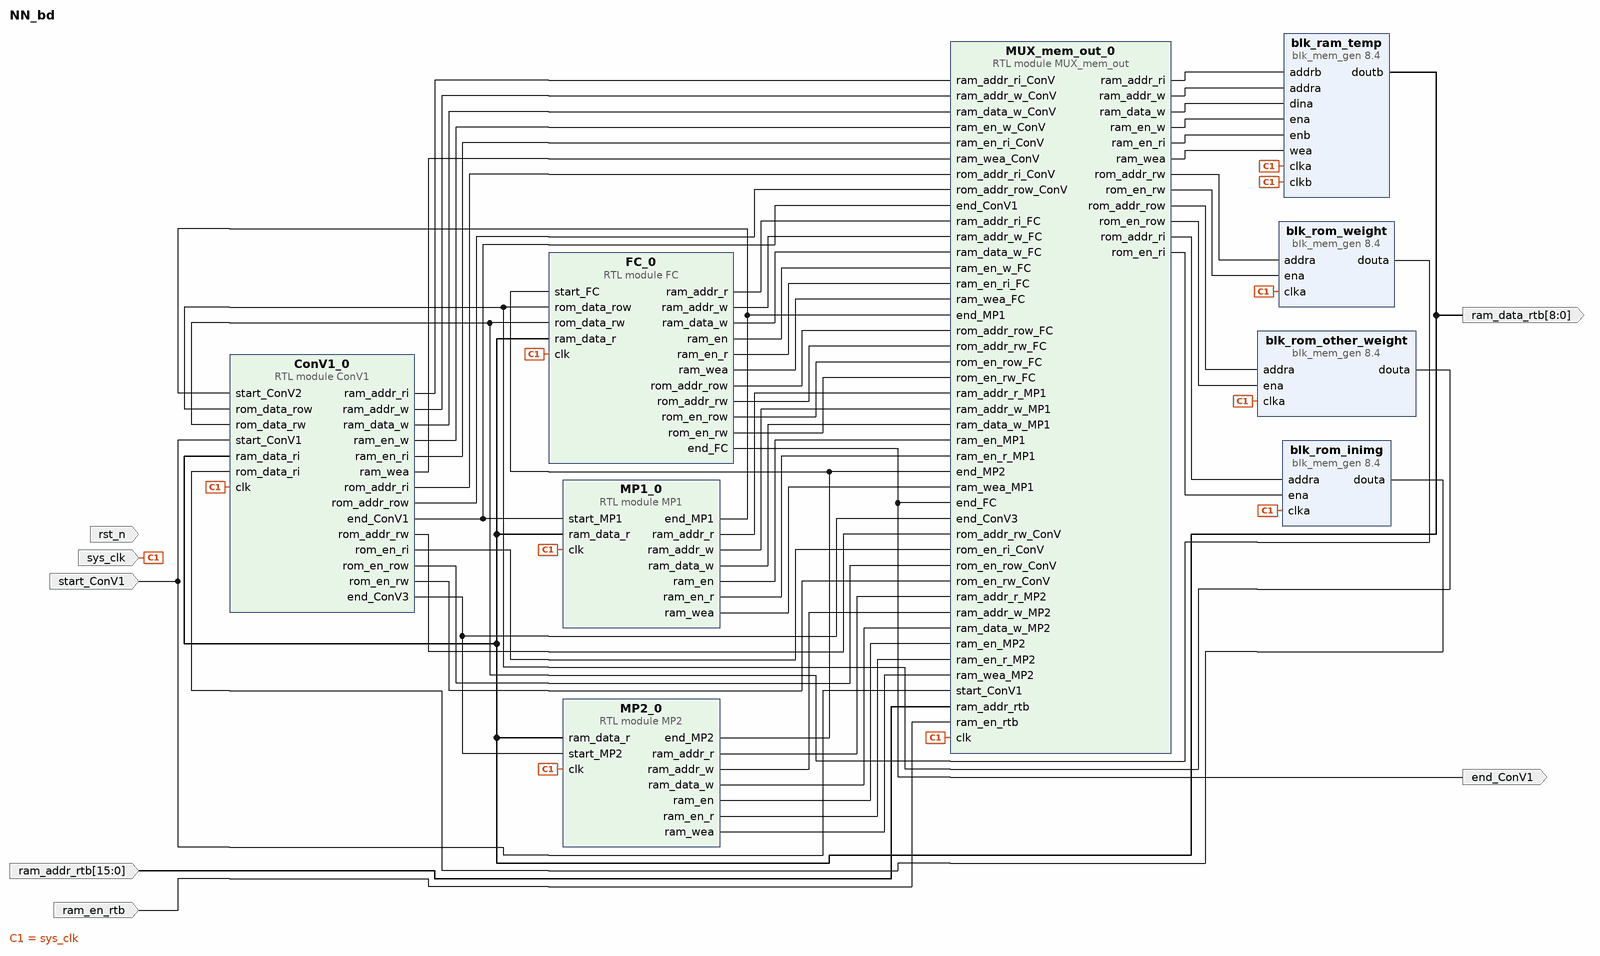
[diagram p0: block diagram of the top level]
# Vivado block design NN_bd, xc7z020clg400-1, Vivado 2021.2
create_bd_design NN_bd

create_bd_port -dir I start_ConV1
create_bd_port -dir I sys_clk
create_bd_port -dir I -from 15 -to 0 ram_addr_rtb
create_bd_port -dir I ram_en_rtb
create_bd_port -dir O end_ConV1
create_bd_port -dir O -from 8 -to 0 ram_data_rtb
create_bd_port -dir I rst_n

create_bd_cell -type ip -vlnv xilinx.com:ip:blk_mem_gen:8.4 blk_rom_weight
set_property -dict [list \
  CONFIG.Coe_File {../../../../../../../CNN_information/coe file/weight.coe} \
  CONFIG.Enable_32bit_Address false \
  CONFIG.Load_Init_File true \
  CONFIG.Memory_Type Single_Port_ROM \
  CONFIG.Port_A_Write_Rate 0 \
  CONFIG.Register_PortA_Output_of_Memory_Primitives true \
  CONFIG.Use_RSTA_Pin false \
  CONFIG.Write_Depth_A 32768 \
  CONFIG.Write_Width_A 8 \
  CONFIG.use_bram_block Stand_Alone \
] [get_bd_cells blk_rom_weight]
create_bd_cell -type ip -vlnv xilinx.com:ip:blk_mem_gen:8.4 blk_rom_other_weight
set_property -dict [list \
  CONFIG.Coe_File {../../../../../../../CNN_information/coe file/M0_bias.coe} \
  CONFIG.Enable_32bit_Address false \
  CONFIG.Load_Init_File true \
  CONFIG.Memory_Type Single_Port_ROM \
  CONFIG.Port_A_Write_Rate 0 \
  CONFIG.Register_PortA_Output_of_Memory_Primitives true \
  CONFIG.Use_RSTA_Pin false \
  CONFIG.Write_Depth_A 512 \
  CONFIG.use_bram_block Stand_Alone \
] [get_bd_cells blk_rom_other_weight]
create_bd_cell -type ip -vlnv xilinx.com:ip:blk_mem_gen:8.4 blk_ram_temp
set_property -dict [list \
  CONFIG.Assume_Synchronous_Clk false \
  CONFIG.Enable_32bit_Address false \
  CONFIG.Enable_B Use_ENB_Pin \
  CONFIG.Load_Init_File false \
  CONFIG.Memory_Type Simple_Dual_Port_RAM \
  CONFIG.Operating_Mode_A NO_CHANGE \
  CONFIG.Port_B_Clock 100 \
  CONFIG.Port_B_Enable_Rate 100 \
  CONFIG.Read_Width_B 9 \
  CONFIG.Register_PortB_Output_of_Memory_Primitives true \
  CONFIG.Use_Byte_Write_Enable false \
  CONFIG.Write_Depth_A 65536 \
  CONFIG.Write_Width_A 9 \
  CONFIG.Write_Width_B 9 \
  CONFIG.use_bram_block Stand_Alone \
] [get_bd_cells blk_ram_temp]
create_bd_cell -type ip -vlnv xilinx.com:ip:blk_mem_gen:8.4 blk_rom_inimg
set_property -dict [list \
  CONFIG.Coe_File {../../../../../../../CNN_information/coe file/input_coe/input_image.coe} \
  CONFIG.Enable_32bit_Address false \
  CONFIG.Load_Init_File true \
  CONFIG.Memory_Type Single_Port_ROM \
  CONFIG.Port_A_Write_Rate 0 \
  CONFIG.Register_PortA_Output_of_Memory_Primitives true \
  CONFIG.Use_RSTA_Pin false \
  CONFIG.Write_Depth_A 4096 \
  CONFIG.Write_Width_A 8 \
  CONFIG.use_bram_block Stand_Alone \
] [get_bd_cells blk_rom_inimg]
create_bd_cell -type module -reference MP1 MP1_0
create_bd_cell -type module -reference ConV1 ConV1_0
create_bd_cell -type module -reference MUX_mem_out MUX_mem_out_0
create_bd_cell -type module -reference FC FC_0
create_bd_cell -type module -reference MP2 MP2_0

# ---- connections ----

connect_bd_net [get_bd_pins ConV1_0/end_ConV1] [get_bd_pins MP1_0/start_MP1] [get_bd_pins MUX_mem_out_0/end_ConV1]
connect_bd_net [get_bd_pins ConV1_0/end_ConV3] [get_bd_pins MUX_mem_out_0/end_ConV3] [get_bd_pins MP2_0/start_MP2]
connect_bd_net [get_bd_pins ConV1_0/ram_addr_ri] [get_bd_pins MUX_mem_out_0/ram_addr_ri_ConV]
connect_bd_net [get_bd_pins ConV1_0/ram_addr_w] [get_bd_pins MUX_mem_out_0/ram_addr_w_ConV]
connect_bd_net [get_bd_pins ConV1_0/ram_data_w] [get_bd_pins MUX_mem_out_0/ram_data_w_ConV]
connect_bd_net -net ConV1_0_ram_en1 [get_bd_pins ConV1_0/ram_en_w] [get_bd_pins MUX_mem_out_0/ram_en_w_ConV]
connect_bd_net [get_bd_pins ConV1_0/ram_en_ri] [get_bd_pins MUX_mem_out_0/ram_en_ri_ConV]
connect_bd_net [get_bd_pins ConV1_0/ram_wea] [get_bd_pins MUX_mem_out_0/ram_wea_ConV]
connect_bd_net [get_bd_pins ConV1_0/rom_addr_ri] [get_bd_pins MUX_mem_out_0/rom_addr_ri_ConV]
connect_bd_net [get_bd_pins ConV1_0/rom_addr_row] [get_bd_pins MUX_mem_out_0/rom_addr_row_ConV]
connect_bd_net [get_bd_pins ConV1_0/rom_addr_rw] [get_bd_pins MUX_mem_out_0/rom_addr_rw_ConV]
connect_bd_net [get_bd_pins ConV1_0/rom_en_ri] [get_bd_pins MUX_mem_out_0/rom_en_ri_ConV]
connect_bd_net [get_bd_pins ConV1_0/rom_en_row] [get_bd_pins MUX_mem_out_0/rom_en_row_ConV]
connect_bd_net [get_bd_pins ConV1_0/rom_en_rw] [get_bd_pins MUX_mem_out_0/rom_en_rw_ConV]
connect_bd_net [get_bd_pins FC_0/end_FC] [get_bd_ports end_ConV1] [get_bd_pins MUX_mem_out_0/end_FC]
connect_bd_net [get_bd_pins FC_0/ram_addr_r] [get_bd_pins MUX_mem_out_0/ram_addr_ri_FC]
connect_bd_net [get_bd_pins FC_0/ram_addr_w] [get_bd_pins MUX_mem_out_0/ram_addr_w_FC]
connect_bd_net [get_bd_pins FC_0/ram_data_w] [get_bd_pins MUX_mem_out_0/ram_data_w_FC]
connect_bd_net [get_bd_pins FC_0/ram_en] [get_bd_pins MUX_mem_out_0/ram_en_w_FC]
connect_bd_net [get_bd_pins FC_0/ram_en_r] [get_bd_pins MUX_mem_out_0/ram_en_ri_FC]
connect_bd_net [get_bd_pins FC_0/ram_wea] [get_bd_pins MUX_mem_out_0/ram_wea_FC]
connect_bd_net [get_bd_pins FC_0/rom_addr_row] [get_bd_pins MUX_mem_out_0/rom_addr_row_FC]
connect_bd_net [get_bd_pins FC_0/rom_addr_rw] [get_bd_pins MUX_mem_out_0/rom_addr_rw_FC]
connect_bd_net [get_bd_pins FC_0/rom_en_row] [get_bd_pins MUX_mem_out_0/rom_en_row_FC]
connect_bd_net [get_bd_pins FC_0/rom_en_rw] [get_bd_pins MUX_mem_out_0/rom_en_rw_FC]
connect_bd_net [get_bd_pins MP1_0/end_MP1] [get_bd_pins ConV1_0/start_ConV2] [get_bd_pins MUX_mem_out_0/end_MP1]
connect_bd_net [get_bd_pins MP1_0/ram_addr_r] [get_bd_pins MUX_mem_out_0/ram_addr_r_MP1]
connect_bd_net [get_bd_pins MP1_0/ram_addr_w] [get_bd_pins MUX_mem_out_0/ram_addr_w_MP1]
connect_bd_net [get_bd_pins MP1_0/ram_data_w] [get_bd_pins MUX_mem_out_0/ram_data_w_MP1]
connect_bd_net [get_bd_pins MP1_0/ram_en] [get_bd_pins MUX_mem_out_0/ram_en_MP1]
connect_bd_net [get_bd_pins MP1_0/ram_en_r] [get_bd_pins MUX_mem_out_0/ram_en_r_MP1]
connect_bd_net [get_bd_pins MP1_0/ram_wea] [get_bd_pins MUX_mem_out_0/ram_wea_MP1]
connect_bd_net [get_bd_pins MP2_0/end_MP2] [get_bd_pins MUX_mem_out_0/end_MP2] [get_bd_pins FC_0/start_FC]
connect_bd_net [get_bd_pins MP2_0/ram_addr_r] [get_bd_pins MUX_mem_out_0/ram_addr_r_MP2]
connect_bd_net [get_bd_pins MP2_0/ram_addr_w] [get_bd_pins MUX_mem_out_0/ram_addr_w_MP2]
connect_bd_net [get_bd_pins MP2_0/ram_data_w] [get_bd_pins MUX_mem_out_0/ram_data_w_MP2]
connect_bd_net [get_bd_pins MP2_0/ram_en] [get_bd_pins MUX_mem_out_0/ram_en_MP2]
connect_bd_net [get_bd_pins MP2_0/ram_en_r] [get_bd_pins MUX_mem_out_0/ram_en_r_MP2]
connect_bd_net [get_bd_pins MP2_0/ram_wea] [get_bd_pins MUX_mem_out_0/ram_wea_MP2]
connect_bd_net -net MUX_mem_out_0_ram_addr_r [get_bd_pins MUX_mem_out_0/ram_addr_ri] [get_bd_pins blk_ram_temp/addrb]
connect_bd_net [get_bd_pins MUX_mem_out_0/ram_addr_w] [get_bd_pins blk_ram_temp/addra]
connect_bd_net [get_bd_pins MUX_mem_out_0/ram_data_w] [get_bd_pins blk_ram_temp/dina]
connect_bd_net -net MUX_mem_out_0_ram_en [get_bd_pins MUX_mem_out_0/ram_en_w] [get_bd_pins blk_ram_temp/ena]
connect_bd_net [get_bd_pins MUX_mem_out_0/ram_en_ri] [get_bd_pins blk_ram_temp/enb]
connect_bd_net [get_bd_pins MUX_mem_out_0/ram_wea] [get_bd_pins blk_ram_temp/wea]
connect_bd_net [get_bd_pins MUX_mem_out_0/rom_addr_ri] [get_bd_pins blk_rom_inimg/addra]
connect_bd_net [get_bd_pins MUX_mem_out_0/rom_addr_row] [get_bd_pins blk_rom_other_weight/addra]
connect_bd_net [get_bd_pins MUX_mem_out_0/rom_addr_rw] [get_bd_pins blk_rom_weight/addra]
connect_bd_net [get_bd_pins MUX_mem_out_0/rom_en_ri] [get_bd_pins blk_rom_inimg/ena]
connect_bd_net [get_bd_pins MUX_mem_out_0/rom_en_row] [get_bd_pins blk_rom_other_weight/ena]
connect_bd_net [get_bd_pins MUX_mem_out_0/rom_en_rw] [get_bd_pins blk_rom_weight/ena]
connect_bd_net [get_bd_pins blk_ram_temp/doutb] \
  [get_bd_ports ram_data_rtb] [get_bd_pins MP1_0/ram_data_r] [get_bd_pins ConV1_0/ram_data_ri] [get_bd_pins FC_0/ram_data_r] \
  [get_bd_pins MP2_0/ram_data_r]
connect_bd_net [get_bd_pins blk_rom_inimg/douta] [get_bd_pins ConV1_0/rom_data_ri]
connect_bd_net [get_bd_pins blk_rom_other_weight/douta] [get_bd_pins ConV1_0/rom_data_row] [get_bd_pins FC_0/rom_data_row]
connect_bd_net [get_bd_pins blk_rom_weight/douta] [get_bd_pins ConV1_0/rom_data_rw] [get_bd_pins FC_0/rom_data_rw]
connect_bd_net [get_bd_ports ram_addr_rtb] [get_bd_pins MUX_mem_out_0/ram_addr_rtb]
connect_bd_net [get_bd_ports ram_en_rtb] [get_bd_pins MUX_mem_out_0/ram_en_rtb]
connect_bd_net -net start_ConV1_1 [get_bd_ports start_ConV1] [get_bd_pins ConV1_0/start_ConV1] [get_bd_pins MUX_mem_out_0/start_ConV1]
connect_bd_net [get_bd_ports sys_clk] \
  [get_bd_pins blk_ram_temp/clkb] [get_bd_pins blk_ram_temp/clka] [get_bd_pins blk_rom_other_weight/clka] \
  [get_bd_pins blk_rom_weight/clka] [get_bd_pins blk_rom_inimg/clka] [get_bd_pins MP1_0/clk] [get_bd_pins ConV1_0/clk] \
  [get_bd_pins MUX_mem_out_0/clk] [get_bd_pins FC_0/clk] [get_bd_pins MP2_0/clk]

validate_bd_design
save_bd_design
